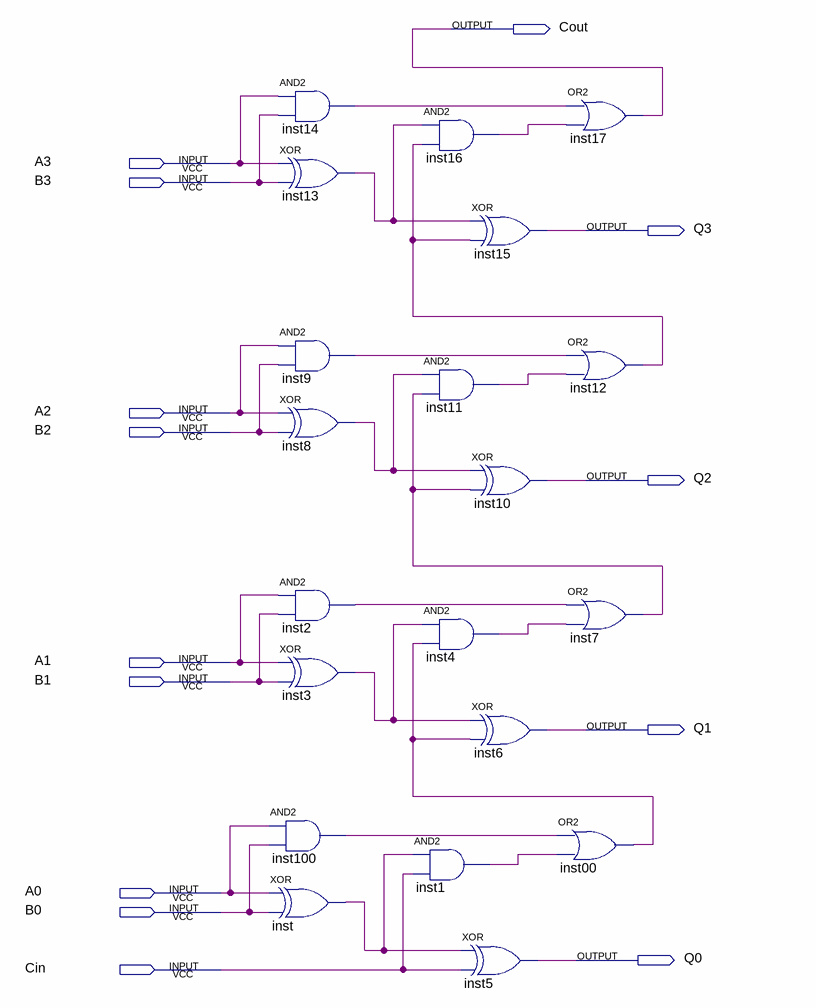
[diagram p0: schematic sheet]
// Quartus schematic qjq.bdf as structural Verilog: 20 symbols, 14 pins
module qjq (
  input  A3,
  input  B3,
  input  A2,
  input  B2,
  input  A1,
  input  B1,
  input  A0,
  input  B0,
  input  Cin,
  output Cout,
  output Q3,
  output Q2,
  output Q1,
  output Q0
);

  wire inst00_out, inst1_out, inst2_out, inst3_out, inst4_out, inst7_out, inst8_out, inst9_out, inst11_out,
       inst12_out, inst13_out, inst14_out, inst16_out, inst100_out, inst_out;

  and inst14 (inst14_out, A3, B3);
  xor inst13 (inst13_out, A3, B3);
  and inst9 (inst9_out, A2, B2);
  xor inst8 (inst8_out, A2, B2);
  and inst2 (inst2_out, A1, B1);
  xor inst3 (inst3_out, A1, B1);
  and inst100 (inst100_out, A0, B0);
  xor inst (inst_out, A0, B0);
  and inst16 (inst16_out, inst13_out, inst12_out);
  and inst11 (inst11_out, inst8_out, inst7_out);
  and inst4 (inst4_out, inst3_out, inst00_out);
  and inst1 (inst1_out, inst_out, Cin);
  xor inst15 (Q3, inst13_out, inst12_out);
  xor inst10 (Q2, inst8_out, inst7_out);
  xor inst6 (Q1, inst3_out, inst00_out);
  xor inst5 (Q0, inst_out, Cin);
  or inst17 (Cout, inst14_out, inst16_out);
  or inst12 (inst12_out, inst9_out, inst11_out);
  or inst7 (inst7_out, inst2_out, inst4_out);
  or inst00 (inst00_out, inst100_out, inst1_out);
endmodule
